# Altium schematic sheet ECAT SWITCH.SchDoc
size 431 x 279 mm; DocumentNumber: 6; SheetNumber: 3; SheetTotal: 13
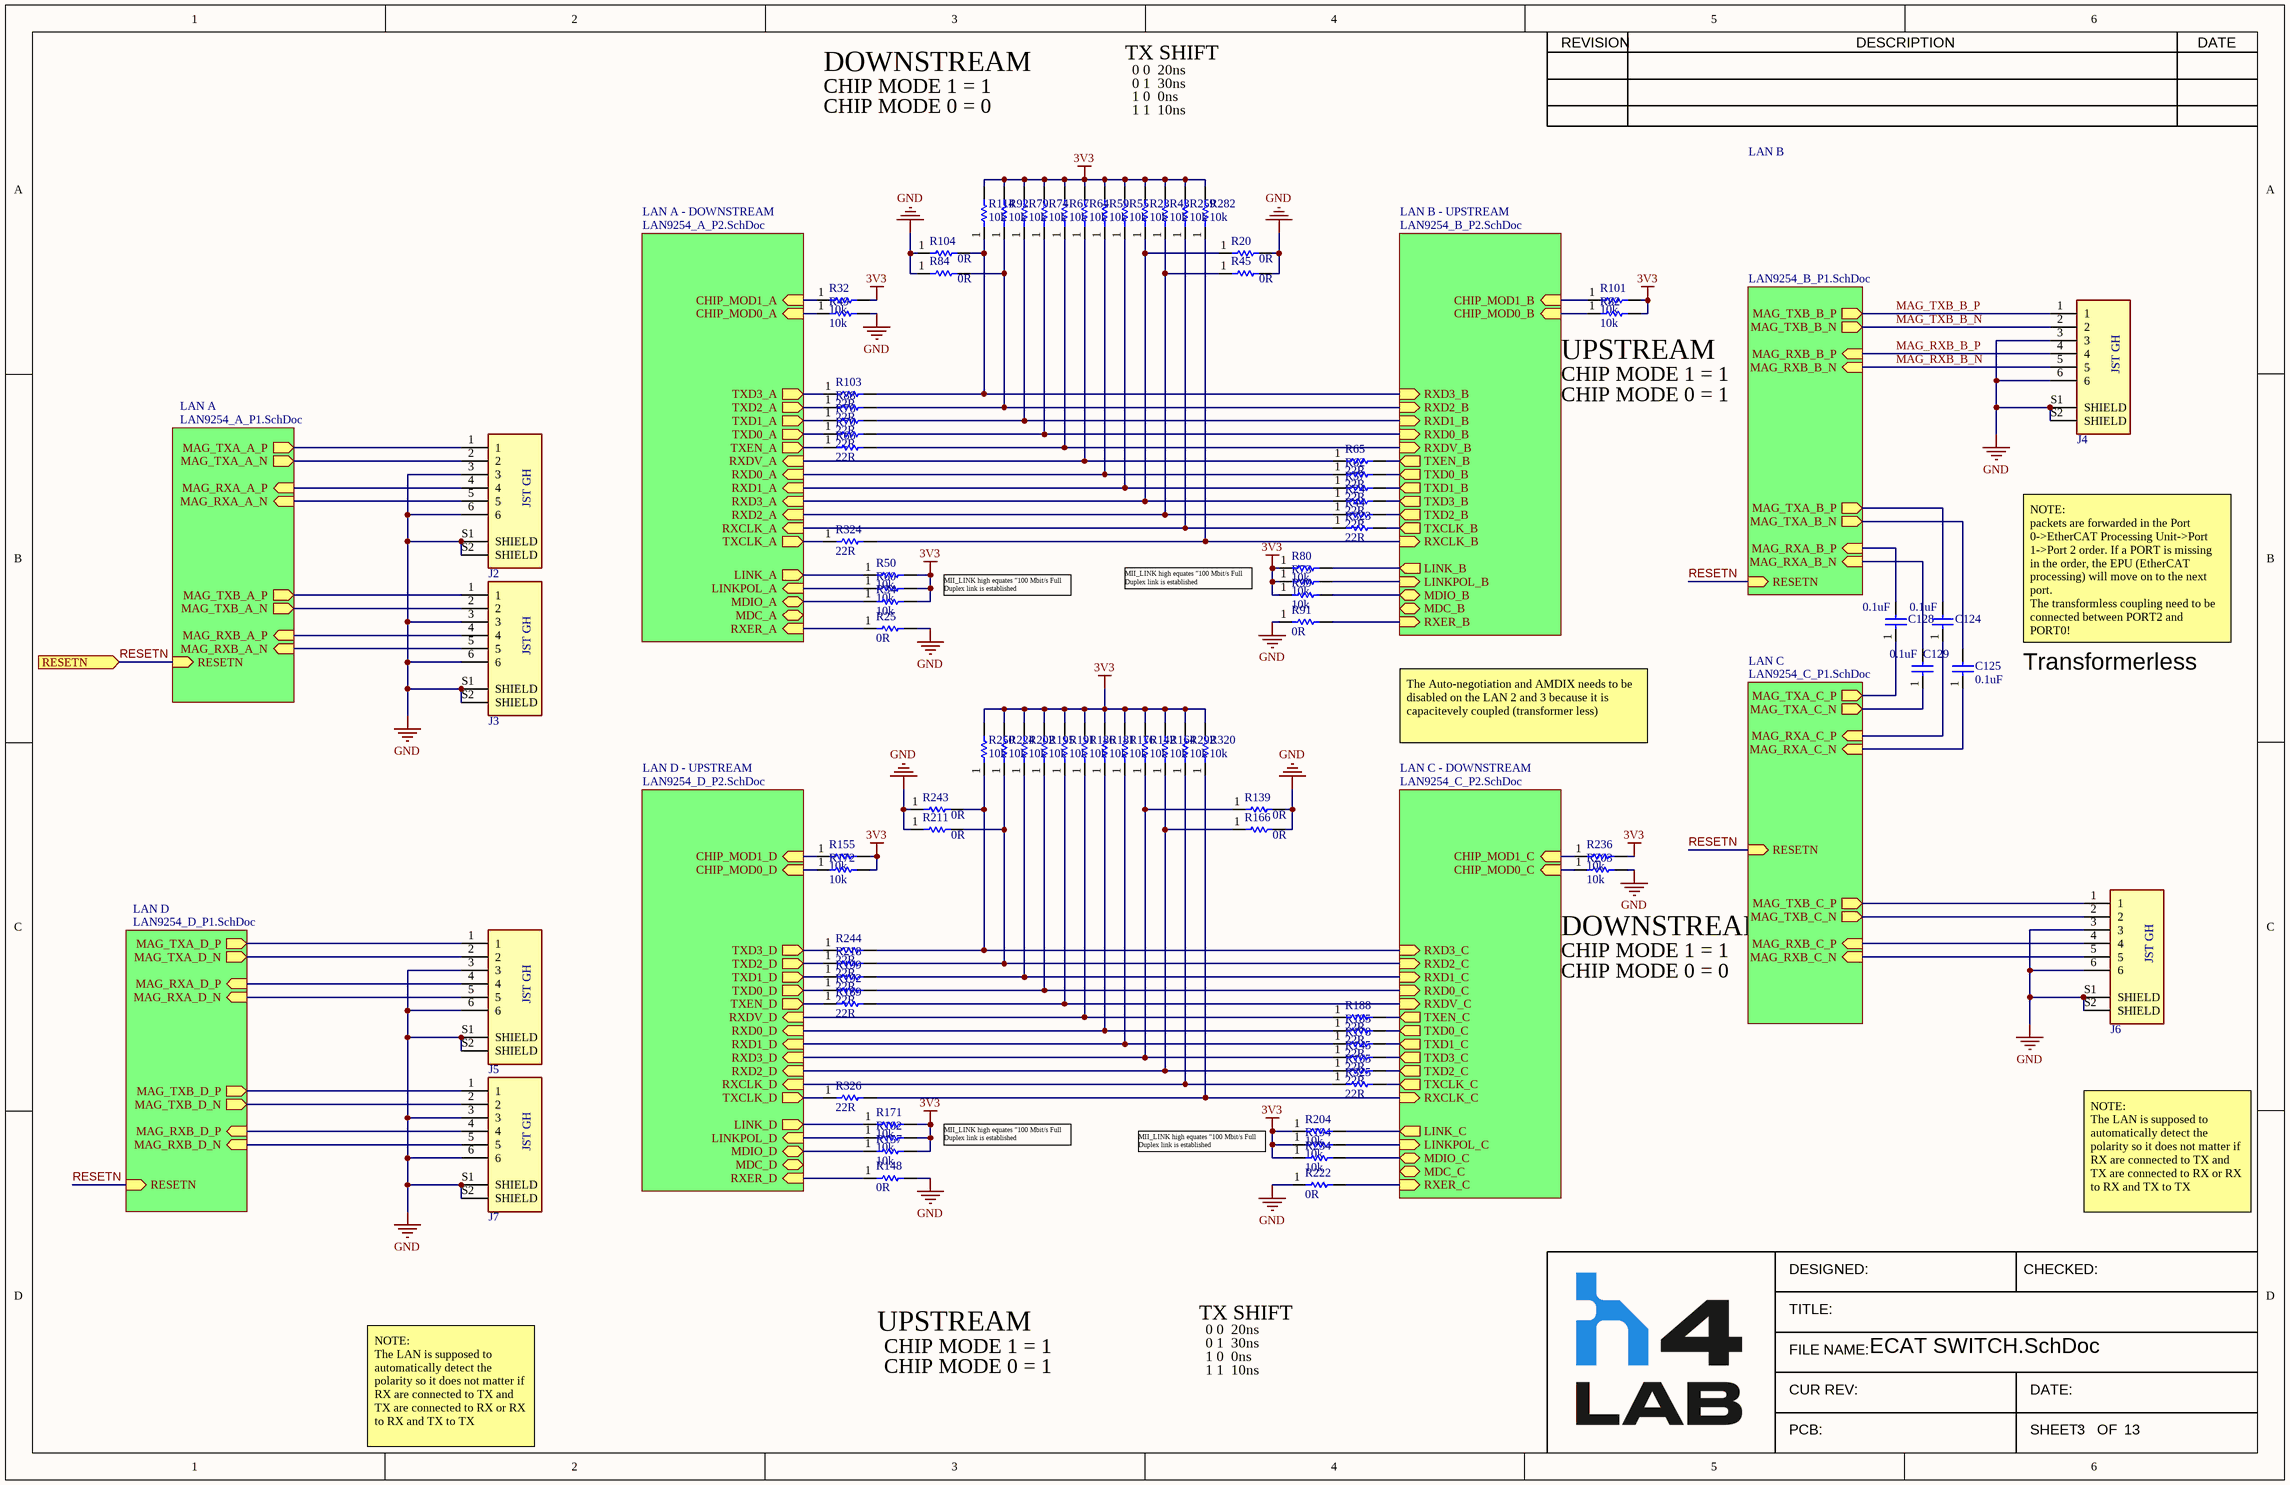
[diagram p0: ECAT SWITCH.SchDoc]

## Parts
C124  value 0.1uF  [CAPC1608X09N(0603)]  (hidden comment: CL10B104KC8NNNC)
C125  value 0.1uF  [CAPC1608X09N(0603)]  (hidden comment: CL10B104KC8NNNC)
C128  value 0.1uF  [CAPC1608X09N(0603)]  (hidden comment: CL10B104KC8NNNC)
C129  value 0.1uF  [CAPC1608X09N(0603)]  (hidden comment: CL10B104KC8NNNC)
J2  BM06B-GHS-TBT  [JST_GH_6POS_STRAI]  (value not drawn)
J3  BM06B-GHS-TBT  [JST_GH_6POS_STRAI]  (value not drawn)
J4  BM06B-GHS-TBT  [JST_GH_6POS_STRAI]  (value not drawn)
J5  BM06B-GHS-TBT  [JST_GH_6POS_STRAI]  (value not drawn)
J6  BM06B-GHS-TBT  [JST_GH_6POS_STRAI]  (value not drawn)
J7  BM06B-GHS-TBT  [JST_GH_6POS_STRAI]  (value not drawn)
R20  value 0R  [RESC1608X09N(0603)]  (hidden comment: RC0603JR-070RL)
R23  value 10k  [RESC1005X06N(0402)]  (hidden comment: RC0402FR-0710KL)
R24  value 22R  [0402]  (hidden comment: CRGP0402F22R)
R25  value 0R  [0402]  (hidden comment: RCS04020000Z0ED)
R32  value 10k  [RESC1005X06N(0402)]  (hidden comment: RC0402FR-0710KL)
R34  value 10k  [RESC1005X06N(0402)]  (hidden comment: RC0402FR-0710KL)
R43  value 10k  [RESC1005X06N(0402)]  (hidden comment: RC0402FR-0710KL)
R44  value 22R  [0402]  (hidden comment: CRGP0402F22R)
R45  value 0R  [RESC1608X09N(0603)]  (hidden comment: RC0603JR-070RL)
R49  value 10k  [RESC1005X06N(0402)]  (hidden comment: RC0402FR-0710KL)
R50  value 10k  [RESC1005X06N(0402)]  (hidden comment: RC0402FR-0710KL)
R55  value 10k  [RESC1005X06N(0402)]  (hidden comment: RC0402FR-0710KL)
R57  value 22R  [0402]  (hidden comment: CRGP0402F22R)
R59  value 10k  [RESC1005X06N(0402)]  (hidden comment: RC0402FR-0710KL)
R60  value 10k  [RESC1005X06N(0402)]  (hidden comment: RC0402FR-0710KL)
R62  value 22R  [0402]  (hidden comment: CRGP0402F22R)
R64  value 10k  [RESC1005X06N(0402)]  (hidden comment: RC0402FR-0710KL)
R65  value 22R  [0402]  (hidden comment: CRGP0402F22R)
R66  value 22R  [0402]  (hidden comment: CRGP0402F22R)
R67  value 10k  [RESC1005X06N(0402)]  (hidden comment: RC0402FR-0710KL)
R70  value 22R  [0402]  (hidden comment: CRGP0402F22R)
R73  value 10k  [RESC1005X06N(0402)]  (hidden comment: RC0402FR-0710KL)
R74  value 10k  [RESC1005X06N(0402)]  (hidden comment: RC0402FR-0710KL)
R76  value 22R  [0402]  (hidden comment: CRGP0402F22R)
R79  value 10k  [RESC1005X06N(0402)]  (hidden comment: RC0402FR-0710KL)
R80  value 10k  [RESC1005X06N(0402)]  (hidden comment: RC0402FR-0710KL)
R82  value 10k  [RESC1005X06N(0402)]  (hidden comment: RC0402FR-0710KL)
R84  value 0R  [RESC1608X09N(0603)]  (hidden comment: RC0603JR-070RL)
R88  value 22R  [0402]  (hidden comment: CRGP0402F22R)
R91  value 0R  [0402]  (hidden comment: RCS04020000Z0ED)
R92  value 10k  [RESC1005X06N(0402)]  (hidden comment: RC0402FR-0710KL)
R99  value 10k  [RESC1005X06N(0402)]  (hidden comment: RC0402FR-0710KL)
R101  value 10k  [RESC1005X06N(0402)]  (hidden comment: RC0402FR-0710KL)
R103  value 22R  [0402]  (hidden comment: CRGP0402F22R)
R104  value 0R  [RESC1608X09N(0603)]  (hidden comment: RC0603JR-070RL)
R114  value 10k  [RESC1005X06N(0402)]  (hidden comment: RC0402FR-0710KL)
R139  value 0R  [RESC1608X09N(0603)]  (hidden comment: RC0603JR-070RL)
R142  value 10k  [RESC1005X06N(0402)]  (hidden comment: RC0402FR-0710KL)
R145  value 22R  [0402]  (hidden comment: CRGP0402F22R)
R148  value 0R  [0402]  (hidden comment: RCS04020000Z0ED)
R155  value 10k  [RESC1005X06N(0402)]  (hidden comment: RC0402FR-0710KL)
R157  value 10k  [RESC1005X06N(0402)]  (hidden comment: RC0402FR-0710KL)
R164  value 10k  [RESC1005X06N(0402)]  (hidden comment: RC0402FR-0710KL)
R165  value 22R  [0402]  (hidden comment: CRGP0402F22R)
R166  value 0R  [RESC1608X09N(0603)]  (hidden comment: RC0603JR-070RL)
R171  value 10k  [RESC1005X06N(0402)]  (hidden comment: RC0402FR-0710KL)
R172  value 10k  [RESC1005X06N(0402)]  (hidden comment: RC0402FR-0710KL)
R176  value 10k  [RESC1005X06N(0402)]  (hidden comment: RC0402FR-0710KL)
R178  value 22R  [0402]  (hidden comment: CRGP0402F22R)
R181  value 10k  [RESC1005X06N(0402)]  (hidden comment: RC0402FR-0710KL)
R182  value 10k  [RESC1005X06N(0402)]  (hidden comment: RC0402FR-0710KL)
R185  value 22R  [0402]  (hidden comment: CRGP0402F22R)
R186  value 10k  [RESC1005X06N(0402)]  (hidden comment: RC0402FR-0710KL)
R188  value 22R  [0402]  (hidden comment: CRGP0402F22R)
R189  value 22R  [0402]  (hidden comment: CRGP0402F22R)
R191  value 10k  [RESC1005X06N(0402)]  (hidden comment: RC0402FR-0710KL)
R192  value 22R  [0402]  (hidden comment: CRGP0402F22R)
R194  value 10k  [RESC1005X06N(0402)]  (hidden comment: RC0402FR-0710KL)
R195  value 10k  [RESC1005X06N(0402)]  (hidden comment: RC0402FR-0710KL)
R199  value 22R  [0402]  (hidden comment: CRGP0402F22R)
R202  value 10k  [RESC1005X06N(0402)]  (hidden comment: RC0402FR-0710KL)
R203  value 10k  [RESC1005X06N(0402)]  (hidden comment: RC0402FR-0710KL)
R204  value 10k  [RESC1005X06N(0402)]  (hidden comment: RC0402FR-0710KL)
R211  value 0R  [RESC1608X09N(0603)]  (hidden comment: RC0603JR-070RL)
R218  value 22R  [0402]  (hidden comment: CRGP0402F22R)
R222  value 0R  [0402]  (hidden comment: RCS04020000Z0ED)
R224  value 10k  [RESC1005X06N(0402)]  (hidden comment: RC0402FR-0710KL)
R234  value 10k  [RESC1005X06N(0402)]  (hidden comment: RC0402FR-0710KL)
R236  value 10k  [RESC1005X06N(0402)]  (hidden comment: RC0402FR-0710KL)
R243  value 0R  [RESC1608X09N(0603)]  (hidden comment: RC0603JR-070RL)
R244  value 22R  [0402]  (hidden comment: CRGP0402F22R)
R250  value 10k  [RESC1005X06N(0402)]  (hidden comment: RC0402FR-0710KL)
R259  value 10k  [RESC1005X06N(0402)]  (hidden comment: RC0402FR-0710KL)
R282  value 10k  [RESC1005X06N(0402)]  (hidden comment: RC0402FR-0710KL)
R292  value 10k  [RESC1005X06N(0402)]  (hidden comment: RC0402FR-0710KL)
R320  value 10k  [RESC1005X06N(0402)]  (hidden comment: RC0402FR-0710KL)
R323  value 22R  [0402]  (hidden comment: CRGP0402F22R)
R324  value 22R  [0402]  (hidden comment: CRGP0402F22R)
R325  value 22R  [0402]  (hidden comment: CRGP0402F22R)
R326  value 22R  [0402]  (hidden comment: CRGP0402F22R)

## Sub-sheets
LAN A = LAN9254_A_P1.SchDoc: MAG_TXA_A_P (out), MAG_TXA_A_N (out), MAG_RXA_A_P (in), MAG_RXA_A_N (in), MAG_TXB_A_P (out), MAG_TXB_A_N (out), MAG_RXB_A_P (in), MAG_RXB_A_N (in), RESETN (in)
LAN A - DOWNSTREAM = LAN9254_A_P2.SchDoc: CHIP_MOD0_A (in), CHIP_MOD1_A (in), TXD3_A (out), TXD2_A (out), TXD1_A (out), TXD0_A (out), TXEN_A (out), RXD0_A (in), RXD1_A (in), LINKPOL_A (in), RXD3_A (in), RXD2_A (in), RXER_A (in), RXCLK_A (in), MDIO_A (bidir), MDC_A (bidir), LINK_A (out), RXDV_A (in), TXCLK_A (out)
LAN B = LAN9254_B_P1.SchDoc: MAG_TXA_B_P (out), MAG_TXA_B_N (out), MAG_RXA_B_P (in), MAG_RXA_B_N (in), MAG_TXB_B_P (out), MAG_TXB_B_N (out), MAG_RXB_B_P (in), MAG_RXB_B_N (in), RESETN (in)
LAN B - UPSTREAM = LAN9254_B_P2.SchDoc: CHIP_MOD0_B (in), CHIP_MOD1_B (in), TXD3_B (out), TXD2_B (out), TXD1_B (out), TXD0_B (out), TXEN_B (out), RXD0_B (in), RXD1_B (in), LINKPOL_B (in), RXD3_B (in), RXD2_B (in), RXER_B (in), RXCLK_B (in), MDIO_B (bidir), MDC_B (bidir), LINK_B (out), RXDV_B (in), TXCLK_B (out)
LAN C = LAN9254_C_P1.SchDoc: MAG_TXA_C_P (out), MAG_TXA_C_N (out), MAG_RXA_C_P (in), MAG_RXA_C_N (in), MAG_TXB_C_P (out), MAG_TXB_C_N (out), MAG_RXB_C_P (in), MAG_RXB_C_N (in), RESETN (in)
LAN C - DOWNSTREAM = LAN9254_C_P2.SchDoc: CHIP_MOD0_C (in), CHIP_MOD1_C (in), TXD3_C (out), TXD2_C (out), TXD1_C (out), TXD0_C (out), TXEN_C (out), RXD0_C (in), RXD1_C (in), LINKPOL_C (in), RXD3_C (in), RXD2_C (in), RXER_C (in), RXCLK_C (in), MDIO_C (bidir), MDC_C (bidir), LINK_C (out), RXDV_C (in), TXCLK_C (out)
LAN D = LAN9254_D_P1.SchDoc: MAG_TXA_D_P (out), MAG_TXA_D_N (out), MAG_RXA_D_P (in), MAG_RXA_D_N (in), MAG_TXB_D_P (out), MAG_TXB_D_N (out), MAG_RXB_D_P (in), MAG_RXB_D_N (in), RESETN (in)
LAN D - UPSTREAM = LAN9254_D_P2.SchDoc: CHIP_MOD0_D (in), CHIP_MOD1_D (in), TXD3_D (out), TXD2_D (out), TXD1_D (out), TXD0_D (out), TXEN_D (out), RXD0_D (in), RXD1_D (in), LINKPOL_D (in), RXD3_D (in), RXD2_D (in), RXER_D (in), RXCLK_D (in), MDIO_D (bidir), MDC_D (bidir), LINK_D (out), RXDV_D (in), TXCLK_D (out)

## Ports
RESETN (in, see Overview[4D], LAN9254_A_P1[2B], LAN9254_B_P1[2B], LAN9254_C_P1[2B], LAN9254_D_P1[2B], POWER[2D])

## Nets
3V3: R23.2 R32.2 R34.2 R43.2 R50.2 R55.2 R59.2 R60.2 R64.2 R67.2 R73.1 R74.2 R79.2 R80.1 R82.2 R92.2 R99.1 R101.2 R114.2 R142.2 R155.2 R157.2 R164.2 R171.2 R172.2 R176.2 R181.2 R182.2 R186.2 R191.2 R194.1 R195.2 R202.2 R204.1 R224.2 R234.1 R236.2 R250.2 R259.2 R282.2 R292.2 R320.2
GND: J2.3 J2.6 J2.S1(SHIELD) J2.S2(SHIELD) J3.3 J3.6 J3.S1(SHIELD) J3.S2(SHIELD) J4.3 J4.6 J4.S1(SHIELD) J4.S2(SHIELD) J5.3 J5.6 J5.S1(SHIELD) J5.S2(SHIELD) J6.3 J6.6 J6.S1(SHIELD) J6.S2(SHIELD) J7.3 J7.6 J7.S1(SHIELD) J7.S2(SHIELD) R20.2 R25.2 R45.2 R49.2 R84.1 R91.1 R104.1 R139.2 R148.2 R166.2 R203.2 R211.1 R222.1 R243.1
MAG_RXB_B_N: J4.5 ; sheet LAN B/MAG_RXB_B_N
MAG_RXB_B_P: J4.4 ; sheet LAN B/MAG_RXB_B_P
MAG_TXB_B_N: J4.2 ; sheet LAN B/MAG_TXB_B_N
MAG_TXB_B_P: J4.1 ; sheet LAN B/MAG_TXB_B_P
RESETN: port RESETN, sheet LAN B/RESETN, sheet LAN C/RESETN, sheet LAN D/RESETN, sheet LAN A/RESETN
NetC124_1: C124.1 ; sheet LAN C/MAG_RXA_C_P
NetC124_2: C124.2 ; sheet LAN B/MAG_TXA_B_P
NetC125_1: C125.1 ; sheet LAN C/MAG_RXA_C_N
NetC125_2: C125.2 ; sheet LAN B/MAG_TXA_B_N
NetC128_1: C128.1 ; sheet LAN C/MAG_TXA_C_P
NetC128_2: C128.2 ; sheet LAN B/MAG_RXA_B_P
NetC129_1: C129.1 ; sheet LAN C/MAG_TXA_C_N
NetC129_2: C129.2 ; sheet LAN B/MAG_RXA_B_N
NetJ2_1: J2.1 ; sheet LAN A/MAG_TXA_A_P
NetJ2_2: J2.2 ; sheet LAN A/MAG_TXA_A_N
NetJ2_4: J2.4 ; sheet LAN A/MAG_RXA_A_P
NetJ2_5: J2.5 ; sheet LAN A/MAG_RXA_A_N
NetJ3_1: J3.1 ; sheet LAN A/MAG_TXB_A_P
NetJ3_2: J3.2 ; sheet LAN A/MAG_TXB_A_N
NetJ3_4: J3.4 ; sheet LAN A/MAG_RXB_A_P
NetJ3_5: J3.5 ; sheet LAN A/MAG_RXB_A_N
NetJ5_1: J5.1 ; sheet LAN D/MAG_TXA_D_P
NetJ5_2: J5.2 ; sheet LAN D/MAG_TXA_D_N
NetJ5_4: J5.4 ; sheet LAN D/MAG_RXA_D_P
NetJ5_5: J5.5 ; sheet LAN D/MAG_RXA_D_N
NetJ6_1: J6.1 ; sheet LAN C/MAG_TXB_C_P
NetJ6_2: J6.2 ; sheet LAN C/MAG_TXB_C_N
NetJ6_4: J6.4 ; sheet LAN C/MAG_RXB_C_P
NetJ6_5: J6.5 ; sheet LAN C/MAG_RXB_C_N
NetJ7_1: J7.1 ; sheet LAN D/MAG_TXB_D_P
NetJ7_2: J7.2 ; sheet LAN D/MAG_TXB_D_N
NetJ7_4: J7.4 ; sheet LAN D/MAG_RXB_D_P
NetJ7_5: J7.5 ; sheet LAN D/MAG_RXB_D_N
NetR20_1: R20.1 R23.1 R24.1 ; sheet LAN A - DOWNSTREAM/RXD3_A
NetR24_2: R24.2 ; sheet LAN B - UPSTREAM/TXD3_B
NetR25_1: R25.1 ; sheet LAN A - DOWNSTREAM/RXER_A
NetR32_1: R32.1 ; sheet LAN A - DOWNSTREAM/CHIP_MOD1_A
NetR34_1: R34.1 ; sheet LAN A - DOWNSTREAM/MDIO_A
NetR43_1: R43.1 R44.1 R45.1 ; sheet LAN A - DOWNSTREAM/RXD2_A
NetR44_2: R44.2 ; sheet LAN B - UPSTREAM/TXD2_B
NetR49_1: R49.1 ; sheet LAN A - DOWNSTREAM/CHIP_MOD0_A
NetR50_1: R50.1 ; sheet LAN A - DOWNSTREAM/LINK_A
NetR55_1: R55.1 R57.1 ; sheet LAN A - DOWNSTREAM/RXD1_A
NetR57_2: R57.2 ; sheet LAN B - UPSTREAM/TXD1_B
NetR59_1: R59.1 R62.1 ; sheet LAN A - DOWNSTREAM/RXD0_A
NetR60_1: R60.1 ; sheet LAN A - DOWNSTREAM/LINKPOL_A
NetR62_2: R62.2 ; sheet LAN B - UPSTREAM/TXD0_B
NetR64_1: R64.1 R65.1 ; sheet LAN A - DOWNSTREAM/RXDV_A
NetR65_2: R65.2 ; sheet LAN B - UPSTREAM/TXEN_B
NetR66_1: R66.1 ; sheet LAN A - DOWNSTREAM/TXEN_A
NetR66_2: R66.2 R67.1 ; sheet LAN B - UPSTREAM/RXDV_B
NetR70_1: R70.1 ; sheet LAN A - DOWNSTREAM/TXD0_A
NetR70_2: R70.2 R74.1 ; sheet LAN B - UPSTREAM/RXD0_B
NetR73_2: R73.2 ; sheet LAN B - UPSTREAM/LINKPOL_B
NetR76_1: R76.1 ; sheet LAN A - DOWNSTREAM/TXD1_A
NetR76_2: R76.2 R79.1 ; sheet LAN B - UPSTREAM/RXD1_B
NetR80_2: R80.2 ; sheet LAN B - UPSTREAM/LINK_B
NetR82_1: R82.1 ; sheet LAN B - UPSTREAM/CHIP_MOD0_B
NetR84_2: R84.2 R88.2 R92.1 ; sheet LAN B - UPSTREAM/RXD2_B
NetR88_1: R88.1 ; sheet LAN A - DOWNSTREAM/TXD2_A
NetR91_2: R91.2 ; sheet LAN B - UPSTREAM/RXER_B
NetR99_2: R99.2 ; sheet LAN B - UPSTREAM/MDIO_B
NetR101_1: R101.1 ; sheet LAN B - UPSTREAM/CHIP_MOD1_B
NetR103_1: R103.1 ; sheet LAN A - DOWNSTREAM/TXD3_A
NetR103_2: R103.2 R104.2 R114.1 ; sheet LAN B - UPSTREAM/RXD3_B
NetR139_1: R139.1 R142.1 R145.1 ; sheet LAN D - UPSTREAM/RXD3_D
NetR145_2: R145.2 ; sheet LAN C - DOWNSTREAM/TXD3_C
NetR148_1: R148.1 ; sheet LAN D - UPSTREAM/RXER_D
NetR155_1: R155.1 ; sheet LAN D - UPSTREAM/CHIP_MOD1_D
NetR157_1: R157.1 ; sheet LAN D - UPSTREAM/MDIO_D
NetR164_1: R164.1 R165.1 R166.1 ; sheet LAN D - UPSTREAM/RXD2_D
NetR165_2: R165.2 ; sheet LAN C - DOWNSTREAM/TXD2_C
NetR171_1: R171.1 ; sheet LAN D - UPSTREAM/LINK_D
NetR172_1: R172.1 ; sheet LAN D - UPSTREAM/CHIP_MOD0_D
NetR176_1: R176.1 R178.1 ; sheet LAN D - UPSTREAM/RXD1_D
NetR178_2: R178.2 ; sheet LAN C - DOWNSTREAM/TXD1_C
NetR181_1: R181.1 R185.1 ; sheet LAN D - UPSTREAM/RXD0_D
NetR182_1: R182.1 ; sheet LAN D - UPSTREAM/LINKPOL_D
NetR185_2: R185.2 ; sheet LAN C - DOWNSTREAM/TXD0_C
NetR186_1: R186.1 R188.1 ; sheet LAN D - UPSTREAM/RXDV_D
NetR188_2: R188.2 ; sheet LAN C - DOWNSTREAM/TXEN_C
NetR189_1: R189.1 ; sheet LAN D - UPSTREAM/TXEN_D
NetR189_2: R189.2 R191.1 ; sheet LAN C - DOWNSTREAM/RXDV_C
NetR192_1: R192.1 ; sheet LAN D - UPSTREAM/TXD0_D
NetR192_2: R192.2 R195.1 ; sheet LAN C - DOWNSTREAM/RXD0_C
NetR194_2: R194.2 ; sheet LAN C - DOWNSTREAM/LINKPOL_C
NetR199_1: R199.1 ; sheet LAN D - UPSTREAM/TXD1_D
NetR199_2: R199.2 R202.1 ; sheet LAN C - DOWNSTREAM/RXD1_C
NetR203_1: R203.1 ; sheet LAN C - DOWNSTREAM/CHIP_MOD0_C
NetR204_2: R204.2 ; sheet LAN C - DOWNSTREAM/LINK_C
NetR211_2: R211.2 R218.2 R224.1 ; sheet LAN C - DOWNSTREAM/RXD2_C
NetR218_1: R218.1 ; sheet LAN D - UPSTREAM/TXD2_D
NetR222_2: R222.2 ; sheet LAN C - DOWNSTREAM/RXER_C
NetR234_2: R234.2 ; sheet LAN C - DOWNSTREAM/MDIO_C
NetR236_1: R236.1 ; sheet LAN C - DOWNSTREAM/CHIP_MOD1_C
NetR243_2: R243.2 R244.2 R250.1 ; sheet LAN C - DOWNSTREAM/RXD3_C
NetR244_1: R244.1 ; sheet LAN D - UPSTREAM/TXD3_D
NetR259_1: R259.1 R323.1 ; sheet LAN A - DOWNSTREAM/RXCLK_A
NetR282_1: R282.1 R324.2 ; sheet LAN B - UPSTREAM/RXCLK_B
NetR292_1: R292.1 R325.1 ; sheet LAN D - UPSTREAM/RXCLK_D
NetR320_1: R320.1 R326.2 ; sheet LAN C - DOWNSTREAM/RXCLK_C
NetR323_2: R323.2 ; sheet LAN B - UPSTREAM/TXCLK_B
NetR324_1: R324.1 ; sheet LAN A - DOWNSTREAM/TXCLK_A
NetR325_2: R325.2 ; sheet LAN C - DOWNSTREAM/TXCLK_C
NetR326_1: R326.1 ; sheet LAN D - UPSTREAM/TXCLK_D

## Notes on the sheet
- DOWNSTREAM
- CHIP MODE 1 = 1
- TX SHIFT
- 0 0  20ns
- 0 1  30ns
- CHIP MODE 0 = 0
- 1 0  0ns
- 1 1  10ns
- UPSTREAM
- CHIP MODE 0 = 1
- MII_LINK high equates “100 Mbit/s Full
  Duplex link is established
- NOTE:
  packets are forwarded in the Port 0->EtherCAT Processing Unit->Port 1->Port 2 order. If a PORT is missing in the order, the EPU (EtherCAT processing) will move on to the next port.
  The transformless coupling need to be connected between PORT2 and PORT0!
- Transformerless
- The Auto-negotiation and AMDIX needs to be disabled on the LAN 2 and 3 because it is capacitevely coupled (transformer less)
- NOTE:
  The LAN is supposed to automatically detect the polarity so it does not matter if RX are connected to TX and TX are connected to RX or RX to RX and TX to TX
- REVISION
- DESCRIPTION
- DATE
- DESIGNED:
- CHECKED:
- TITLE:
- FILE NAME:
- CUR REV:
- PCB:
- SHEET:
- DATE:
- OF
- (in symbol BM06B-GHS-TBT_JST_6POS_1.25MM_CON) JST GH

## Library data of the parts
C124 C125 C128 C129 = 0.1uF_100V_0603_CAP: CAP CER 0.1UF 100V X7R 0603; Tolerance: 10%; MPN: CL10B104KC8NNNC; Volage Rating: 100V; Temp Coefficent: X7R; Mounting Type: Surface Mount; Case/Package: 0603; Supplier 1: Digi-Key; Supplier Part Number 1: 1276-6807-1-ND
J2-J7 = BM06B-GHS-TBT_JST_6POS_1.25MM_CON: CONN HEADER GH TOP 6POS 1.25MM; Manufacturer: JST; Manufacturer Part Number: BM06B-GHS-TBT(LF)(SN)(N); Pitch: 0.049inch; Max Current Rating: 1A; Contact Resistance: 50mR; Number of Positions: 6; Max Voltage Rating (AC): 50V; Connector Type: Outer Shroud Contact; Number of Rows: 1; Supplier 1: Digi-Key; RoHS: Yes; Category: Connectors; Pricing 1: 1=0.51000, 10=0.47700, 100=0.36540, 500=0.31770, 1000=0.26211 (USD); Mount: Surface Mount; Color: Natural; Contact Plating: Tin,Copper; Contact Material: Bronze; Housing Color: Beige; Housing Material: Polyamide; Min Operating Temperature: -25°C; Max Operating Temperature: 85°C; Fastening Type: Ramp; Packaging: Tape and Reel; Termination: Solder; Orientation: Straight; Length: 10.75mm; Depth: 4.25mm; Lead Free: Lead Free; ComponentLink1URL: https://datasheet.ciiva.com/712/egh-712475.pdf?src-supplier=Digi-Key; ComponentLink1Description: https://datasheet.ciiva.com/712/egh-712475.pdf?src-supplier=Digi-Key; ComponentLink2URL: https://datasheet.ciiva.com/712/egh-712476.pdf?src-supplier=Digi-Key; ComponentLink2Description: https://datasheet.ciiva.com/712/egh-712476.pdf?src-supplier=Digi-Key; Supplier Part Number 1: 455-1582-1-ND; Series: GH; Contact Type: Outer Shroud Contact; ComponentLink3URL: https://datasheet.ciiva.com/730/egh-730626.pdf?src-supplier=Digi-Key; ComponentLink3Description: https://datasheet.ciiva.com/730/egh-730626.pdf?src-supplier=Digi-Key
R20 R45 R84 R104 R139 R166 R211 R243 = 0R_1/10W_0603_RES: RES SMD 0 OHM JUMPER 1/10W 0603; MPN: RC0603JR-070RL; Tolerance: Jumper; Power: 1/10W; Package/Case: 0603; Supplier 1: Digi-Key; Supplier Part Number 1: 311-0.0GRDKR-ND
R23 R32 R34 R43 R49 R50 R55 R59 R60 R64 R67 R73 R74 R79 R80 R82 R92 R99 R101 R114 R142 R155 R157 R164 R171 R172 R176 R181 R182 R186 R191 R194 R195 R202-R204 R224 R234 R236 R250 R259 R282 R292 R320 = 10k_1/16W_0402_RES: RES SMD 10K OHM 1% 1/16W 0402; MPN: RC0402FR-0710KL; Tolerance: 1%; Power: 1/16W; Size: 0402
R24 R44 R57 R62 R65 R66 R70 R76 R88 R103 R145 R165 R178 R185 R188 R189 R192 R199 R218 R244 R323-R326 = 22R_1/8W_1%_0402_CRGP0402F22R_RES: Res Thick Film 0402 22 Ohm 1% 0.125W(1/8W) ±200ppm/C Pad SMD T/R; Manufacturer: TE Connectivity; Supplier 1: Digi-Key; Manufacturer Part Number: CRGP0402F22R; RoHS: Yes; Category: Chip SMD Resistors; Stock 1: 34384; Pricing 1: 1=0.12000, 10=0.10900, 100=0.04180, 1000=0.01839, 2500=0.01588, 5000=0.01421 (USD); RoHS Compliant: Yes; Supplier Part Number 1: A130335CT-ND
R25 R91 R148 R222 = 0R_1/5W_0402_RCS04020000Z0ED_RES: VISHAY - RCS04020000Z0ED - SMD Chip Resistor, 0402 [1005 Metric], 0 ohm, RCS Series, 50 V, Thick Film, 200 mW; Manufacturer: Vishay Dale; Resistance: 0mR; Max Power Dissipation: 200mW; Supplier 1: Digi-Key; Supplier Part Number 1: 541-2877-1-ND; Manufacturer Part Number: RCS04020000Z0ED; RoHS: Yes; Category: Chip SMD Resistors; Stock 1: 18214; Pricing 1: 1=0.10000, 10=0.08300, 25=0.05760, 50=0.04480, 100=0.03200, 250=0.02496, 500=0.01984, 1000=0.01408, 5000=0.01088 (USD); Case/Package: 0402; Case Code (Metric): 1005; Case Code (Imperial): 0402; Min Operating Temperature: -55°C; Max Operating Temperature: 155°C; Packaging: Tape and Reel; Resistor Type: Thick Film; Number of Terminations: 2; Features: Automotive AEC-Q200; Length: 0.039inch; Width: 0.02inch; Height: 0.016inch; RoHS Compliant: Yes; ComponentLink1URL: http://www.farnell.com/datasheets/2618474.pdf?src-supplier=Farnell; ComponentLink1Description: http://www.farnell.com/datasheets/2618474.pdf?src-supplier=Farnell; ComponentLink2URL: http://www.vishay.com/docs/20065/rcse3.pdf?src-supplier=Digi-Key; ComponentLink2Description: http://www.vishay.com/docs/20065/rcse3.pdf?src-supplier=Digi-Key; ComponentLink3URL: http://www.farnell.com/datasheets/2618474.pdf?src-supplier=Element14; ComponentLink3Description: http://www.farnell.com/datasheets/2618474.pdf?src-supplier=Element14; ComponentLink4URL: http://www.farnell.com/datasheets/2618474.pdf?src-supplier=Newark; ComponentLink4Description: http://www.farnell.com/datasheets/2618474.pdf?src-supplier=Newark